# Altium project CANtact.PrjPcb
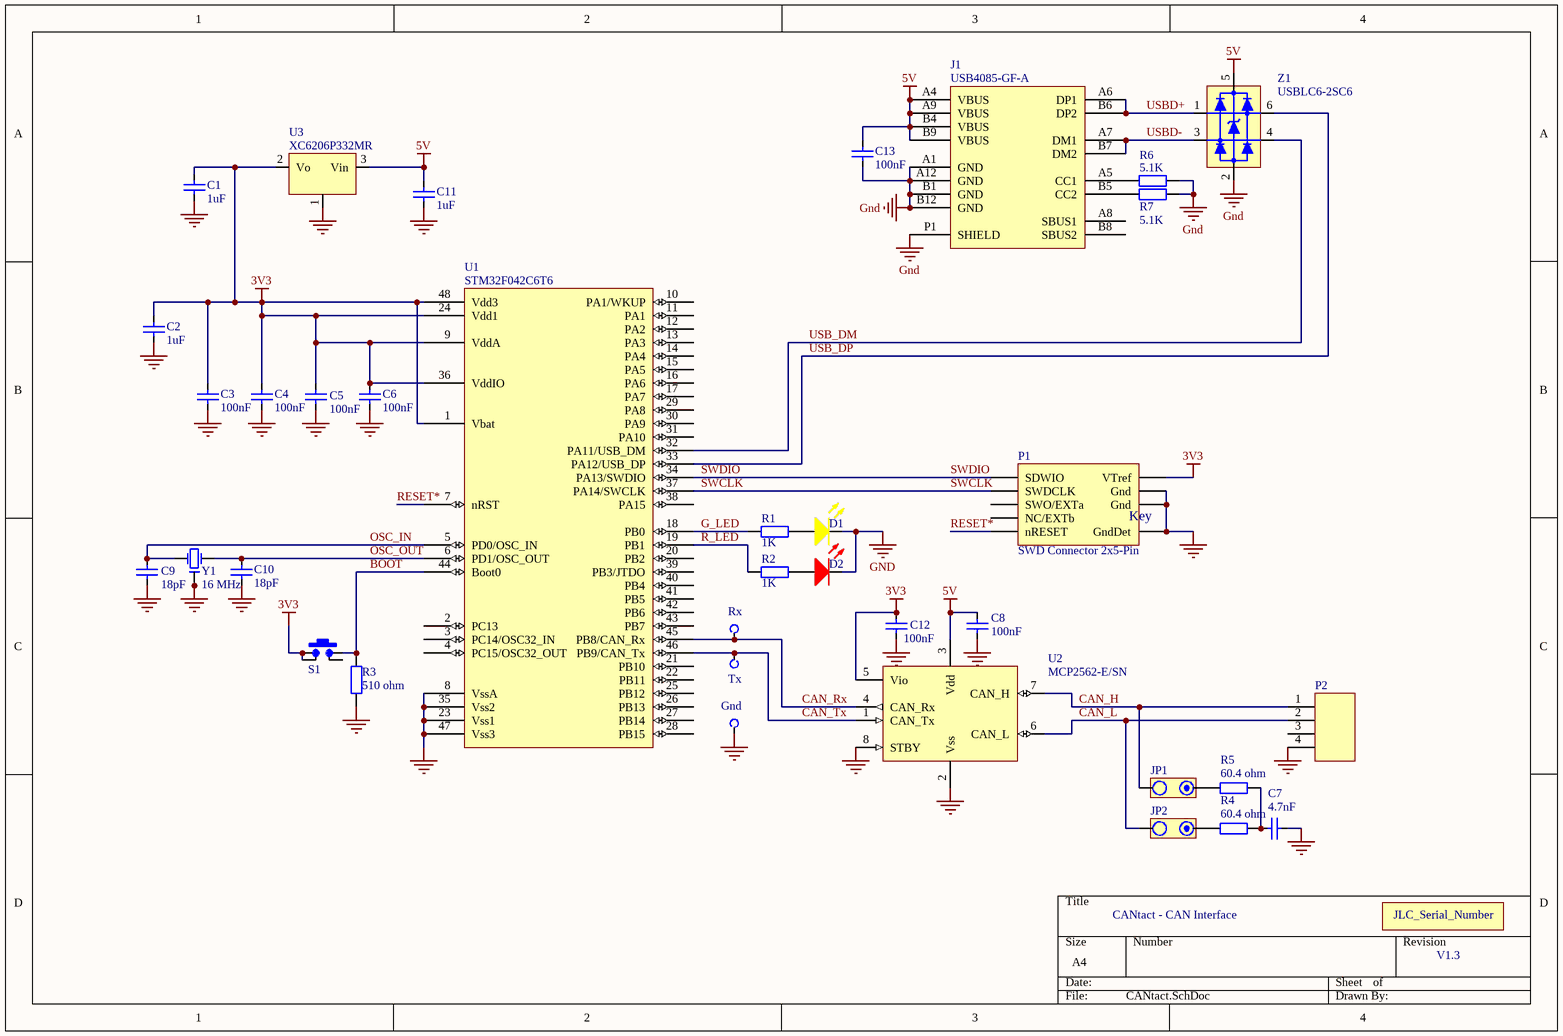
[diagram p0: CANtact.SchDoc]
ProjectDescription: CANtact - CAN Interface; ProjectRevision: V1.3
1 sheet, 37 parts. Net scope: global (net labels, ports and power ports of the same name join across sheets).
Board file: CANtact.PcbDoc

## Sheet CANtact.SchDoc
size A4

### Parts
C1  1uF  [CCNP1608-0603]
C2  1uF  [CCNP1608-0603]
C3  100nF  [CCNP1608-0603]
C4  100nF  [CCNP1608-0603]
C5  100nF  [CCNP1608-0603]
C6  100nF  [CCNP1608-0603]
C7  4.7nF  [CCNP2012-0805]
C8  100nF  [CCNP1608-0603]
C9  18pF  [CCNP1608-0603]
C10  18pF  [CCNP1608-0603]
C11  1uF  [CCNP1608-0603]
C12  100nF  [CCNP1608-0603]
C13  100nF  [CCNP1608-0603]
D1  LED Yellow  [LED1608-0603-Yellow]  (value not drawn)
D2  LED Red  [LED1608-0603-RED]  (value not drawn)
Gnd  TP  [PCBPIN - 0.7mm]  (value not drawn)
J1  USB4085-GF-A  [USB4085-GF-A]
JLC_Serial_Number  JLC_Serial_Number  [JLC_Serial_Number]  (value not drawn)  (no BOM)
JP1  PIN2X1  [HDR1X2S]  (value not drawn)
JP2  PIN2X1  [HDR1X2S]  (value not drawn)
P1  SWD Connector 2x5-Pin  [SWD-2x5-Jig-Pads]  (no BOM)
P2  Terminal4_BUCHANAN  [TYCO-282834-4]  (value not drawn)
R1  1K  [CR1608-0603]
R2  1K  [CR1608-0603]
R3  510 ohm  [CR1608-0603]
R4  60.4 ohm  [CR2012-0805]
R5  60.4 ohm  [CR2012-0805]
R6  5.1K  [CR1608-0603]
R7  5.1K  [CR1608-0603]
Rx  TP  [PCBPIN - 0.7mm]  (value not drawn)
S1  SMD-SW-4_5.1x5.1x2.0  [SMD-SW-4_5.1x5.1x2.0]  (value not drawn)
Tx  TP  [PCBPIN - 0.7mm]  (value not drawn)
U1  STM32F042C6T6  [TSQFP50P900X900-48N]
U2  MCP2562-E/SN  [SO-8_L]
U3  XC6206P332MR  [SOT23_N]
Y1  16 MHz  [Crystal_SMD_3.2x2.5]
Z1  USBLC6-2SC6  [SOT23-6_N]

### Nets
3V3: C1.2 C2.2 C3.1 C4.1 C5.2 C6.1 C12.1 P1.1(VTref) S1.1 S1.1b U1.1(Vbat) U1.9(VddA) U1.24(Vdd1) U1.36(VddIO) U1.48(Vdd3) U2.5(Vio) U3.2(Vo)
5V: C8.2 C11.2 C13.2 J1.A4(VBUS) J1.A9(VBUS) J1.B4(VBUS) J1.B9(VBUS) U2.3(Vdd) U3.3(Vin) Z1.5
GND: C1.1 C2.1 C3.2 C4.2 C5.1 C6.2 C7.1 C8.1 C9.1 C10.2 C11.1 C12.2 C13.1 D1.K D2.K Gnd.1(TP) J1.A1(GND) J1.A12(GND) J1.B1(GND) J1.B12(GND) J1.P1(SHIELD) P1.3(Gnd) P1.5(Gnd) P1.9(GndDet) P2.4 R3.2 R6.2 R7.2 U1.8(VssA) U1.23(Vss1) U1.35(Vss2) U1.47(Vss3) U2.2(Vss) U2.8(STBY) U3.1(Gnd) Y1.2(Gnd) Y1.4(Gnd) Z1.2
BOOT: R3.1 S1.2b U1.44(Boot0)
CAN_H: JP1.2 P2.1 U2.7(CAN_H)
CAN_L: JP2.2 P2.2 U2.6(CAN_L)
CAN_Rx: Rx.1(TP) U1.45(PB8/CAN_Rx) U2.4(CAN_Rx)
CAN_Tx: Tx.1(TP) U1.46(PB9/CAN_Tx) U2.1(CAN_Tx)
G_LED: R1.1 U1.18(PB0)
OSC_IN: C9.2 U1.5(PD0/OSC_IN) Y1.1(OSC1)
OSC_OUT: C10.1 U1.6(PD1/OSC_OUT) Y1.3(OSC2)
R_LED: R2.1 U1.19(PB1)
RESET*: P1.10(nRESET) U1.7(nRST)
SWCLK: P1.4(SWDCLK) U1.37(PA14/SWCLK)
SWDIO: P1.2(SDWIO) U1.34(PA13/SWDIO)
USB_DM: U1.32(PA11/USB_DM) Z1.4
USB_DP: U1.33(PA12/USB_DP) Z1.6
USBD+: J1.A6(DP1) J1.B6(DP2) Z1.1
USBD-: J1.A7(DM1) J1.B7(DM2) Z1.3
NetC7_2: C7.2 R4.2 R5.1
NetD1_A: D1.A R1.2
NetD2_A: D2.A R2.2
NetJ1_A5: J1.A5(CC1) R6.1
NetJ1_B5: J1.B5(CC2) R7.1
NetJP1_1: JP1.1 R5.2
NetJP2_1: JP2.1 R4.1

Not connected (* = marked no-connect by the designer): J1 A8(SBUS1) B8(SBUS2); P1 6(SWO/EXTa) 8(NC/EXTb); P2 3; S1 2; U1 2(PC13) 3(PC14/OSC32_IN) 4(PC15/OSC32_OUT) 10(PA1/WKUP) 11(PA1) 12(PA2) 13(PA3) 14(PA4) 15(PA5) 16(PA6) 17(PA7) 20(PB2) 21(PB10) 22(PB11) 25(PB12) 26(PB13) 27(PB14) 28(PB15) 29(PA8) 30(PA9) 31(PA10) 38(PA15) 39(PB3/JTDO) 40(PB4) 41(PB5) 42(PB6) 43(PB7)

### Notes on the sheet
- (in symbol SWD2X5_JIG) Key

### Library data of the parts
C1-C6 C8-C12 = Cap_CCNP_0603: Capacitor non-polar SMT 0603; Manufacturer: Generic Components; Class: Passive; Published: 08/06/2000; Publisher: Altium Hobart Technology Centre; SubClass: Capacitor; Farnell PN: *; Digikey: *
  C1 C2 C11: LCSC: C15849; Value: 1uF
  C3-C6 C8 C12: Value: 100nF; LCSC: C14663
  C9 C10: Value: 18pF; LCSC: C1647
C7 = Cap_CCNP_0805: Capacitor non-polar SMT 0805; Manufacturer: Generic Components; Class: Passive; Published: 08/06/2000; Publisher: Altium Hobart Technology Centre; SubClass: Capacitor; Farnell PN: *; Digikey: *; Value: 4.7nF; LCSC: C1744
C13 = Cap_CCNP_0603: Capacitor non-polar SMT 0603; Manufacturer: Generic Components; Class: Passive; Parameter 1: C14663; Published: 08/06/2000; Publisher: Altium Hobart Technology Centre; SubClass: Capacitor; Farnell PN: *; Digikey: *; Value: 100nF; LCSC: C14663
D1 = LED-0603-Yellow: LED 0603 Yellow; Manufacturer: Generic Components; Class I: Optoelectronic; Published: 8-Jun-2000; Revision: July-2002: Re-released for DXP Platform.; Publisher: Altium Limited; Class II: LED; Farnell PN: 5790852; Digikey: *; LCSC: C72038
D2 = LED-0603-Red: LED 0603 Red; Manufacturer: Generic Components; Class I: Optoelectronic; Published: 8-Jun-2000; Revision: July-2002: Re-released for DXP Platform.; Publisher: Altium Limited; Class II: LED; Farnell PN: 1581239; Digikey: *; LCSC: C2286
Gnd Rx Tx = TP: Test Point; Digikey: *; Farnell PN: *
J1 = USB4085-GF-A: USB-C, USB 2.0 Receptacle Connector 16 Position Through Hole, Right Angle; Angle: 90; Part Number: USB4085-GF-A; Digikey Part Number: 2073-USB4085-GF-ACT-ND; Digikey Link: https://www.digikey.ee/product-detail/en/gct/USB4085-GF-A/2073-USB4085-GF-ACT-ND/9859733; Digikey: 2073-USB4085-GF-ACT-ND; Farnell PN: 2924867; LCSC: *
P1 = SWD2X5_JIG: LatestRevisionDate: 17-Jul-2002; LatestRevisionNote: Re-released for DXP Platform.; Publisher: Altium Limited; Farnell PN: 1865285; LCSC: *
P2 = Terminal4_BUCHANAN: 2.54mm Terminal Block; Farnell PN: 2396253
R1-R3 R6 R7 = Res_CR0603: Resistor SMT 0603; Manufacturer: Generic Components; Class: Passive; Published: 08/06/2000; Publisher: Altium Hobart Technology Centre; SubClass: Resistor; Farnell PN: *; Digikey: *
  R1 R2: Value: 1K; LCSC: C21190
  R3: Value: 510 ohm; LCSC: C23193
  R6 R7: Value: 5.1K; LCSC: C23186
R4 R5 = Res_CR0805: Resistor SMT 0805; Manufacturer: Generic Components; Class: Passive; Published: 08/06/2000; Publisher: Altium Hobart Technology Centre; SubClass: Resistor; Farnell PN: *; Digikey: *; Value: 60.4 ohm; LCSC: C72998
S1 = SW_PB-TS: Tactile Switch SPST 5.10mm X 5.10mm; Revision: 1.0; LCSC: C318888
U1 = STM32F042C6T6: ARM Microcontroller with CAN; Farnell PN: 2750630; LCSC: C88447
U2 = MCP2562-E/SN: CAN Tranceiver; Farnell PN: 2362839; LCSC: C53609
U3 = XC6206P332MR: 3V3 200mA, LDO regulator (Low ESR ceramic caps); Farnell PN: 8796980; LCSC: C5446
Y1 = Crystal 16MHz: Crystal SMD 3.2 x 2.5 x 0.7 mm; Manufacturer: Generic Components; Class: Oscillator; SubClass: Crystal Oscillator; Published: 08/06/2000; Publisher: Altium Hobart Technology Centre; Digikey: *; Farnell PN: *; LCSC: C13738
Z1 = USBLC6-2SC6: TVS diode array for USB; Digikey: 497-5235-1-ND; Farnell PN: 1269406; LCSC: C7519
JP1 JP2 = PIN2X1: Digikey: *; Farnell PN: *